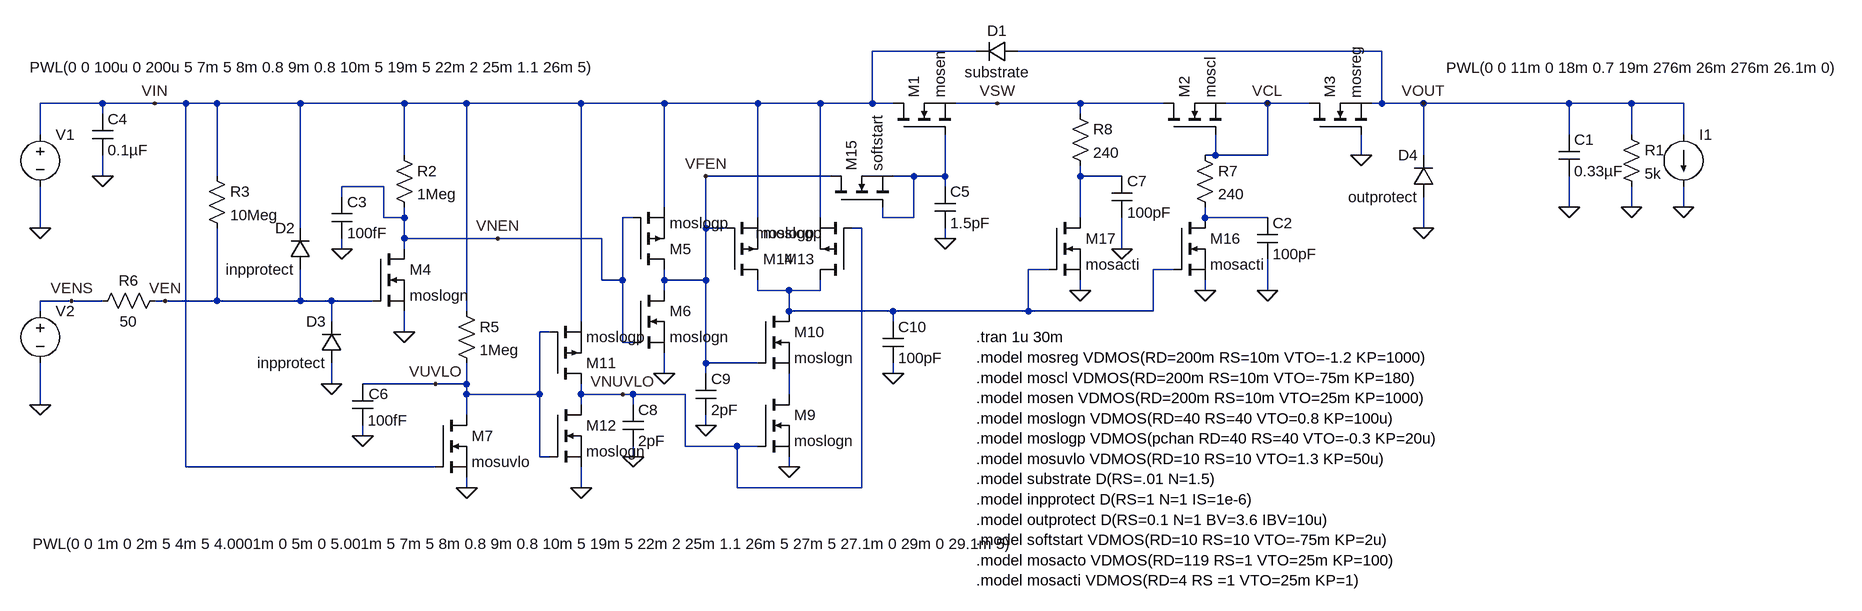
[diagram p0: schematic tlv733p.asc]
tlv733p.asc, the LTspice schematic file:
Version 4
SHEET 1 1808 1368
WIRE 448 176 288 176
WIRE 1072 176 512 176
WIRE -896 256 -992 256
WIRE -816 256 -896 256
WIRE -768 256 -816 256
WIRE -720 256 -768 256
WIRE -592 256 -720 256
WIRE -432 256 -592 256
WIRE -336 256 -432 256
WIRE -160 256 -336 256
WIRE -32 256 -160 256
WIRE 112 256 -32 256
WIRE 208 256 112 256
WIRE 288 256 288 176
WIRE 288 256 208 256
WIRE 320 256 288 256
WIRE 480 256 416 256
WIRE 608 256 480 256
WIRE 736 256 608 256
WIRE 896 256 832 256
WIRE 960 256 896 256
WIRE 1072 256 1072 176
WIRE 1072 256 1056 256
WIRE 1136 256 1072 256
WIRE 1360 256 1136 256
WIRE 1456 256 1360 256
WIRE 1536 256 1456 256
WIRE -896 272 -896 256
WIRE 608 272 608 256
WIRE -992 304 -992 256
WIRE 1360 304 1360 256
WIRE 1456 304 1456 256
WIRE 1536 304 1536 256
WIRE -432 336 -432 256
WIRE 816 336 816 304
WIRE 816 336 800 336
WIRE 896 336 896 256
WIRE 896 336 816 336
WIRE 1040 336 1040 304
WIRE 1136 336 1136 256
WIRE -896 368 -896 336
WIRE -720 368 -720 256
WIRE 224 368 32 368
WIRE 352 368 320 368
WIRE 400 368 400 304
WIRE 400 368 352 368
WIRE 608 368 608 352
WIRE 672 368 608 368
WIRE -464 384 -528 384
WIRE 400 384 400 368
WIRE -528 400 -528 384
WIRE -32 416 -32 256
WIRE 1360 416 1360 368
WIRE 1456 416 1456 384
WIRE 1536 416 1536 384
WIRE -464 432 -464 384
WIRE -432 432 -432 416
WIRE -432 432 -464 432
WIRE -80 432 -96 432
WIRE 112 432 112 256
WIRE 208 432 208 256
WIRE 304 432 304 416
WIRE 352 432 352 368
WIRE 352 432 304 432
WIRE 608 432 608 368
WIRE 800 432 800 416
WIRE 896 432 800 432
WIRE -992 448 -992 384
WIRE -592 448 -592 256
WIRE 32 448 32 368
WIRE 64 448 32 448
WIRE 272 448 256 448
WIRE 1136 448 1136 400
WIRE -432 464 -432 432
WIRE -288 464 -432 464
WIRE -128 464 -288 464
WIRE 400 464 400 448
WIRE -528 480 -528 464
WIRE -432 480 -432 464
WIRE 672 480 672 432
WIRE 560 512 528 512
WIRE 752 512 720 512
WIRE -128 528 -128 464
WIRE -96 528 -96 432
WIRE -96 528 -128 528
WIRE -32 528 -32 512
WIRE 32 528 32 448
WIRE 32 528 -32 528
WIRE -32 544 -32 528
WIRE 112 544 112 528
WIRE 160 544 112 544
WIRE 208 544 208 528
WIRE 208 544 160 544
WIRE 608 544 608 528
WIRE 800 544 800 528
WIRE 896 544 896 496
WIRE -944 560 -992 560
WIRE -896 560 -944 560
WIRE -800 560 -816 560
WIRE -720 560 -720 448
WIRE -720 560 -800 560
WIRE -592 560 -592 512
WIRE -592 560 -720 560
WIRE -544 560 -592 560
WIRE -480 560 -544 560
WIRE -992 576 -992 560
WIRE -336 576 -336 256
WIRE 160 576 160 544
WIRE 320 576 160 576
WIRE 528 576 528 512
WIRE 528 576 320 576
WIRE 720 576 720 512
WIRE 720 576 528 576
WIRE -544 592 -544 560
WIRE -160 592 -160 256
WIRE 320 592 320 576
WIRE -432 608 -432 576
WIRE -208 608 -224 608
WIRE -96 624 -96 528
WIRE -80 624 -96 624
WIRE 32 656 32 528
WIRE 112 656 32 656
WIRE -32 672 -32 640
WIRE 32 672 32 656
WIRE 320 672 320 656
WIRE -544 688 -544 656
WIRE -384 688 -496 688
WIRE -336 688 -336 656
WIRE -336 688 -384 688
WIRE -336 704 -336 688
WIRE -224 704 -224 608
WIRE -224 704 -336 704
WIRE -160 704 -160 688
WIRE -96 704 -160 704
WIRE -80 704 -96 704
WIRE 0 704 -80 704
WIRE 160 704 160 672
WIRE -992 720 -992 656
WIRE -160 720 -160 704
WIRE -80 720 -80 704
WIRE -336 736 -336 704
WIRE 32 752 32 736
WIRE -496 768 -496 752
WIRE 0 784 0 704
WIRE 80 784 0 784
WIRE 112 784 80 784
WIRE -224 800 -224 704
WIRE -208 800 -224 800
WIRE -80 800 -80 784
WIRE -768 816 -768 256
WIRE -384 816 -768 816
WIRE 160 816 160 800
WIRE -336 848 -336 832
WIRE -160 848 -160 816
WIRE 80 848 80 784
WIRE 272 848 272 448
WIRE 272 848 80 848
FLAG -992 448 0
FLAG 1040 336 0
FLAG 1360 416 0
FLAG 1456 416 0
FLAG -992 720 0
FLAG 896 544 0
FLAG 1136 256 VOUT
FLAG -816 256 VIN
FLAG 896 256 VCL
FLAG 480 256 VSW
FLAG -896 368 0
FLAG -528 480 0
FLAG 400 464 0
FLAG -336 848 0
FLAG -944 560 VENS
FLAG -496 768 0
FLAG -288 464 VNEN
FLAG -384 688 VUVLO
FLAG 672 480 0
FLAG 1536 416 0
FLAG 32 368 VFEN
FLAG -432 608 0
FLAG -160 848 0
FLAG -32 672 0
FLAG 160 816 0
FLAG -80 800 0
FLAG 32 752 0
FLAG 320 672 0
FLAG -544 688 0
FLAG 1136 448 0
FLAG -96 704 VNUVLO
FLAG -800 560 VEN
FLAG 800 544 0
FLAG 608 544 0
SYMBOL nmos 320 304 R270
SYMATTR InstName M1
SYMATTR Value mosen
SYMBOL nmos 736 304 R270
SYMATTR InstName M2
SYMATTR Value moscl
SYMBOL nmos 960 304 R270
SYMATTR InstName M3
SYMATTR Value mosreg
SYMBOL res 1440 288 R0
SYMATTR InstName R1
SYMATTR Value 5k
SYMBOL cap 1344 304 R0
SYMATTR InstName C1
SYMATTR Value 0.33µF
SYMBOL voltage -992 288 R0
WINDOW 3 -16 -88 Left 2
SYMATTR Value PWL(0 0 100u 0 200u 5 7m 5 8m 0.8 9m 0.8 10m 5 19m 5 22m 2 25m 1.1 26m 5)
SYMATTR InstName V1
SYMBOL voltage -992 560 R0
WINDOW 3 -12 374 Left 2
SYMATTR Value PWL(0 0 1m 0 2m 5 4m 5 4.0001m 0 5m 0 5.001m 5 7m 5 8m 0.8 9m 0.8 10m 5 19m 5 22m 2 25m 1.1 26m 5 27m 5 27.1m 0 29m 0 29.1m 5)
SYMATTR InstName V2
SYMBOL cap 880 432 R0
SYMATTR InstName C2
SYMATTR Value 100pF
SYMBOL nmos -480 480 R0
SYMATTR InstName M4
SYMATTR Value moslogn
SYMBOL cap -544 400 R0
SYMATTR InstName C3
SYMATTR Value 100fF
SYMBOL cap -912 272 R0
SYMATTR InstName C4
SYMATTR Value 0.1µF
SYMBOL cap 384 384 R0
SYMATTR InstName C5
SYMATTR Value 1.5pF
SYMBOL res -448 320 R0
SYMATTR InstName R2
SYMATTR Value 1Meg
SYMBOL nmos -384 736 R0
SYMATTR InstName M7
SYMATTR Value mosuvlo
SYMBOL cap -512 688 R0
WINDOW 0 25 15 Left 2
SYMATTR InstName C6
SYMATTR Value 100fF
SYMBOL cap 656 368 R0
SYMATTR InstName C7
SYMATTR Value 100pF
SYMBOL current 1536 304 R0
WINDOW 3 -365 -103 Left 2
SYMATTR Value PWL(0 0 11m 0 18m 0.7 19m 276m 26m 276m 26.1m 0)
SYMATTR InstName I1
SYMBOL diode 512 160 R90
WINDOW 0 0 32 VBottom 2
WINDOW 3 32 32 VTop 2
SYMATTR InstName D1
SYMATTR Value substrate
SYMBOL res -352 560 R0
SYMATTR InstName R5
SYMATTR Value 1Meg
SYMBOL pmos -208 688 M180
SYMATTR InstName M11
SYMATTR Value moslogp
SYMBOL nmos -208 720 R0
SYMATTR InstName M12
SYMATTR Value moslogn
SYMBOL pmos -80 512 M180
SYMATTR InstName M5
SYMATTR Value moslogp
SYMBOL nmos -80 544 R0
SYMATTR InstName M6
SYMATTR Value moslogn
SYMBOL nmos 112 704 R0
SYMATTR InstName M9
SYMATTR Value moslogn
SYMBOL nmos 112 576 R0
SYMATTR InstName M10
SYMATTR Value moslogn
SYMBOL pmos 256 528 R180
SYMATTR InstName M13
SYMATTR Value moslogp
SYMBOL pmos 64 528 M180
SYMATTR InstName M14
SYMATTR Value moslogp
SYMBOL nmos 224 416 R270
SYMATTR InstName M15
SYMATTR Value softstart
SYMBOL cap -96 720 R0
SYMATTR InstName C8
SYMATTR Value 2pF
SYMBOL cap 16 672 R0
SYMATTR InstName C9
SYMATTR Value 2pF
SYMBOL cap 304 592 R0
SYMATTR InstName C10
SYMATTR Value 100pF
SYMBOL diode -576 512 R180
WINDOW 0 24 64 Left 2
WINDOW 3 24 0 Left 2
SYMATTR InstName D2
SYMATTR Value inpprotect
SYMBOL diode -528 656 R180
WINDOW 0 24 64 Left 2
WINDOW 3 24 0 Left 2
SYMATTR InstName D3
SYMATTR Value inpprotect
SYMBOL diode 1152 400 R180
WINDOW 0 24 64 Left 2
WINDOW 3 24 0 Left 2
SYMATTR InstName D4
SYMATTR Value outprotect
SYMBOL res -736 352 R0
SYMATTR InstName R3
SYMATTR Value 10Meg
SYMBOL res -912 576 R270
WINDOW 0 32 56 VTop 2
WINDOW 3 0 56 VBottom 2
SYMATTR InstName R6
SYMATTR Value 50
SYMBOL nmos 752 432 R0
SYMATTR InstName M16
SYMATTR Value mosacti
SYMBOL res 784 320 R0
SYMATTR InstName R7
SYMATTR Value 240
SYMBOL nmos 560 432 R0
SYMATTR InstName M17
SYMATTR Value mosacti
SYMBOL res 592 256 R0
SYMATTR InstName R8
SYMATTR Value 240
TEXT 448 616 Left 2 !.tran 1u 30m\n.model mosreg VDMOS(RD=200m RS=10m VTO=-1.2 KP=1000)\n.model moscl VDMOS(RD=200m RS=10m VTO=-75m KP=180)\n.model mosen VDMOS(RD=200m RS=10m VTO=25m KP=1000)\n.model moslogn VDMOS(RD=40 RS=40 VTO=0.8 KP=100u)\n.model moslogp VDMOS(pchan RD=40 RS=40 VTO=-0.3 KP=20u)\n.model mosuvlo VDMOS(RD=10 RS=10 VTO=1.3 KP=50u)\n.model substrate D(RS=.01 N=1.5)\n.model inpprotect D(RS=1 N=1 IS=1e-6)\n.model outprotect D(RS=0.1 N=1 BV=3.6 IBV=10u)\n.model softstart VDMOS(RD=10 RS=10 VTO=-75m KP=2u)\n.model mosacto VDMOS(RD=119 RS=1 VTO=25m KP=100)\n.model mosacti VDMOS(RD=4 RS =1 VTO=25m KP=1)

The netlist it stands for:
* tlv733p.asc
M1 VIN N001 VSW VSW mosen
M2 VSW VCL VCL VCL moscl
M3 VCL 0 VOUT VOUT mosreg
R1 VOUT 0 5k
C1 VOUT 0 0.33µF
V1 VIN 0 PWL(0 0 100u 0 200u 5 7m 5 8m 0.8 9m 0.8 10m 5 19m 5 22m 2 25m 1.1 26m 5)
V2 VENS 0 PWL(0 0 1m 0 2m 5 4m 5 4.0001m 0 5m 0 5.001m 5 7m 5 8m 0.8 9m 0.8 10m 5 19m 5 22m 2 25m 1.1 26m 5 27m 5 27.1m 0 29m 0 29.1m 5)
C2 N003 0 100pF
M4 VNEN VEN 0 0 moslogn
C3 VNEN 0 100fF
C4 VIN 0 0.1µF
C5 N001 0 1.5pF
R2 VIN VNEN 1Meg
M7 VUVLO VIN 0 0 mosuvlo
C6 VUVLO 0 100fF
C7 N002 0 100pF
I1 VOUT 0 PWL(0 0 11m 0 18m 0.7 19m 276m 26m 276m 26.1m 0)
D1 VOUT VIN substrate
R5 VIN VUVLO 1Meg
M11 VNUVLO VUVLO VIN VIN moslogp
M12 VNUVLO VUVLO 0 0 moslogn
M5 VFEN VNEN VIN VIN moslogp
M6 VFEN VNEN 0 0 moslogn
M9 N005 VNUVLO 0 0 moslogn
M10 N004 VFEN N005 N005 moslogn
M13 N004 VNUVLO VIN VIN moslogp
M14 N004 VFEN VIN VIN moslogp
M15 VFEN N001 N001 N001 softstart
C8 VNUVLO 0 2pF
C9 VFEN 0 2pF
C10 N004 0 100pF
D2 VEN VIN inpprotect
D3 0 VEN inpprotect
D4 0 VOUT outprotect
R3 VIN VEN 10Meg
R6 VENS VEN 50
M16 N003 N004 0 0 mosacti
R7 VCL N003 240
M17 N002 N004 0 0 mosacti
R8 VSW N002 240
.model D D
.lib standard.dio
.model NMOS NMOS
.model PMOS PMOS
.lib standard.mos
.tran 1u 30m
.model mosreg VDMOS(RD=200m RS=10m VTO=-1.2 KP=1000)
.model moscl VDMOS(RD=200m RS=10m VTO=-75m KP=180)
.model mosen VDMOS(RD=200m RS=10m VTO=25m KP=1000)
.model moslogn VDMOS(RD=40 RS=40 VTO=0.8 KP=100u)
.model moslogp VDMOS(pchan RD=40 RS=40 VTO=-0.3 KP=20u)
.model mosuvlo VDMOS(RD=10 RS=10 VTO=1.3 KP=50u)
.model substrate D(RS=.01 N=1.5)
.model inpprotect D(RS=1 N=1 IS=1e-6)
.model outprotect D(RS=0.1 N=1 BV=3.6 IBV=10u)
.model softstart VDMOS(RD=10 RS=10 VTO=-75m KP=2u)
.model mosacto VDMOS(RD=119 RS=1 VTO=25m KP=100)
.model mosacti VDMOS(RD=4 RS =1 VTO=25m KP=1)
.backanno
.end